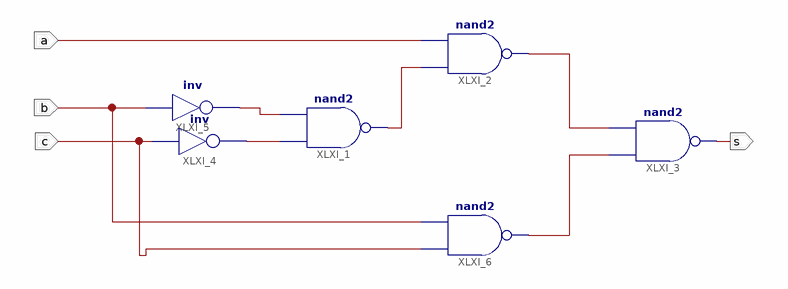
[diagram p0: schematic sheet 1]
// Xilinx ISE schematic TP21.sch (spartan3e) as structural Verilog: 6 symbols, 4 ports
module TP21 (
  input  a,
  input  b,
  input  c,
  output s
);

  wire XLXN_1, XLXN_2, XLXN_3, XLXN_5, XLXN_8;

  nand XLXI_1 (XLXN_1, XLXN_8, XLXN_5);
  nand XLXI_2 (XLXN_3, XLXN_1, a);
  nand XLXI_3 (s, XLXN_2, XLXN_3);
  not XLXI_4 (XLXN_8, c);
  not XLXI_5 (XLXN_5, b);
  nand XLXI_6 (XLXN_2, c, b);
endmodule
